# EAGLE design Companion_Board (EAGLE 7.5.0)
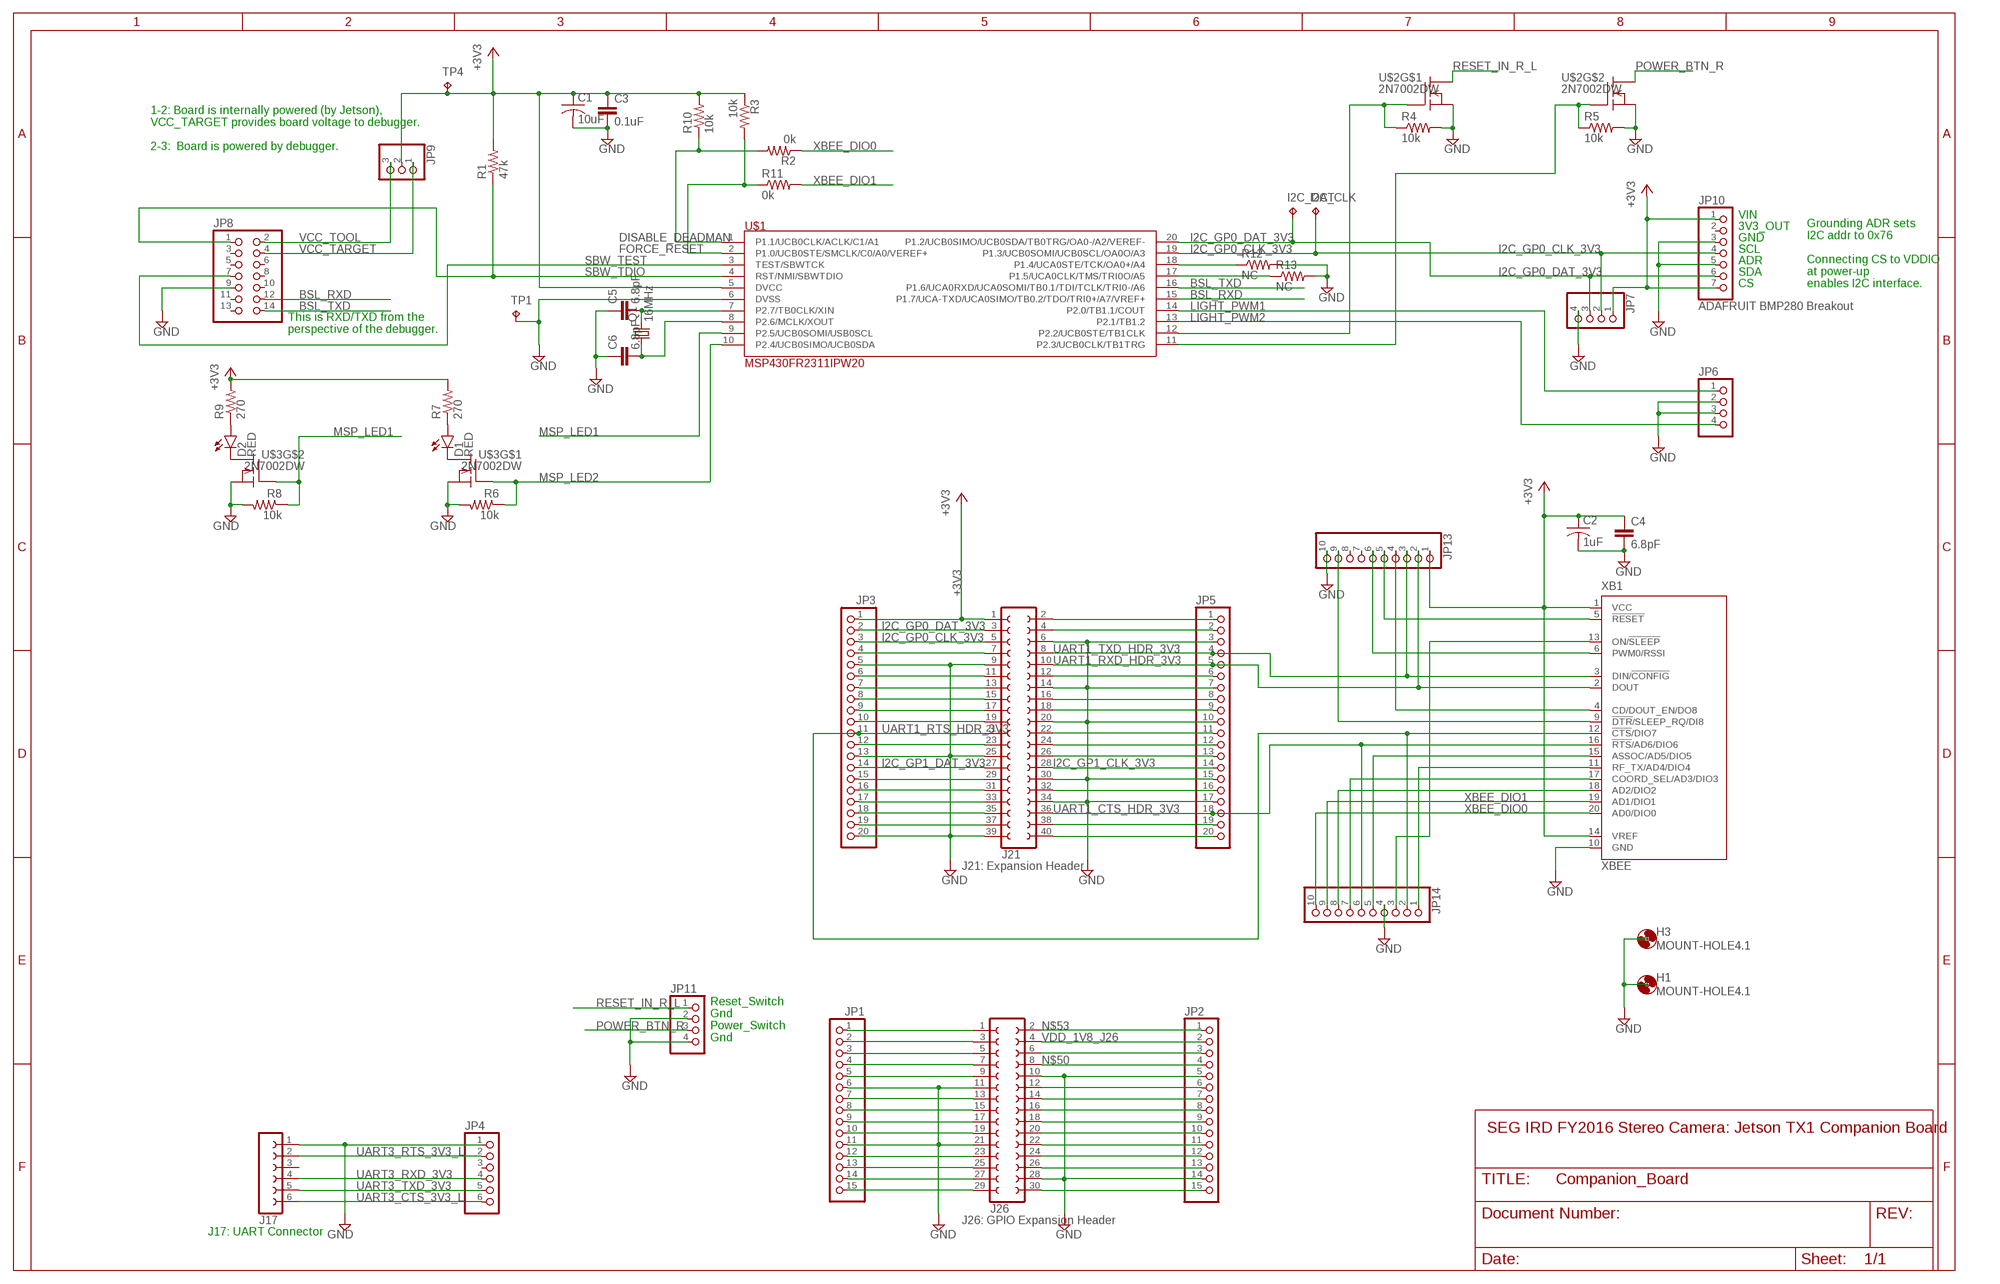
[diagram p0: schematic, sheet 1]

## Parts
C1  10uF  C-USC1206  [C1206]
C2  1uF  C-USC1206  [C1206]
C3  0.1uF  C-EUC0805  [C0805]
C4  6.8pF  C-EUC0805  [C0805]
C5  6.8pF  C-EUC0805  [C0805]
C6  6.8pF  C-EUC0805  [C0805]
D1  RED  LED-RED1206  [LED-1206]
D2  RED  LED-RED1206  [LED-1206]
H1  MOUNT-HOLE4.1  [4,1]
H3  MOUNT-HOLE4.1  [4,1]
I2C_CLK  TPPAD1-13  [P1-13]
I2C_DAT  TPPAD1-13  [P1-13]
J17  FE06-1  [FE06]
J21  FE20-2  [FE20-2]
J26  FE15-2  [FE15-2]
JP1  PINHD-1X15  [1X15]
JP2  PINHD-1X15  [1X15]
JP3  PINHD-1X20  [1X20]
JP4  PINHD-1X6  [1X06]
JP5  PINHD-1X20  [1X20]
JP6  PINHD-1X4/90  [1X04/90]
JP7  PINHD-1X4  [1X04]
JP8  PINHD-2X7  [2X07]
JP9  PINHD-1X3  [1X03]
JP10  ADAFRUIT BMP280 Breakout  ADAFRUIT_BMP280_BREAKOUT  [1X07]
JP11  PINHD-1X4/90  [1X04/90]
JP13  PINHD-1X10  [1X10]
JP14  PINHD-1X10  [1X10]
Q1  16MHz  CRYSTALHC49UP  [HC49UP]
R1  47k  R-US_R0805  [R0805]
R2  0k  R-US_R0805  [R0805]
R3  10k  R-US_R0805  [R0805]
R4  10k  R-US_R0805  [R0805]
R5  10k  R-US_R0805  [R0805]
R6  10k  R-US_R0805  [R0805]
R7  270  R-US_R0805  [R0805]
R8  10k  R-US_R0805  [R0805]
R9  270  R-US_R0805  [R0805]
R10  10k  R-US_R0805  [R0805]
R11  0k  R-US_R0805  [R0805]
R12  NC  R-US_R0805  [R0805]
R13  NC  R-US_R0805  [R0805]
TP1  TPPAD1-13  [P1-13]
TP4  TPPAD1-13  [P1-13]
U$1  MSP430FR2311IPW20  [SOP65P640X120-20N]
U$2  2N7002DW  [SOT363]
U$3  2N7002DW  [SOT363]
XB1  XBEE  [XBEE]

## Nets
+3V3: C1.1 C2.1 C3.1 C4.1 J21.1 JP3.1 JP7.1 JP9.2 JP10.1 JP10.7 JP13.1 R1.2 R3.1 R7.2 R9.2 R10.2 TP4.TP U$1.5(DVCC) XB1.1(VCC) XB1.14(VREF)
BSL_RXD: JP8.12 U$1.15(P1.7/UCA-TXD/UCA0SIMO/TB0.2/TDO/TRI0+/A7/VREF+)
BSL_TXD: JP8.14 U$1.16(P1.6/UCA0RXD/UCA0SOMI/TB0.1/TDI/TCLK/TRI0-/A6)
DISABLE_DEADMAN: R2.2 R10.1 U$1.1(P1.1/UCB0CLK/ACLK/C1/A1)
FORCE_RESET: R3.2 R11.1 U$1.2(P1.0/UCB0STE/SMCLK/C0/A0/VEREF+)
GND: C1.2 C2.2 C3.2 C4.2 C5.1 C6.1 J17.1 J21.6 J21.9 J21.14 J21.20 J21.25 J21.30 J21.34 J21.39 J26.10 J26.11 J26.21 J26.28 JP1.6 JP1.11 JP2.5 JP2.14 JP3.5 JP3.13 JP3.20 JP4.1 JP5.3 JP5.7 JP5.10 JP5.15 JP5.17 JP6.2 JP6.3 JP7.4 JP8.9 JP10.3 JP10.5 JP11.2 JP11.4 JP13.10 JP14.4 R4.2 R5.2 R6.2 R8.2 R12.2 R13.2 TP1.TP U$1.6(DVSS) U$2.1(S) U$2.4(S) U$3.1(S) U$3.4(S) XB1.10(GND)
I2C_GP0_CLK_3V3: I2C_CLK.TP J21.5 JP3.3 JP7.2 JP10.4 U$1.19(P1.3/UCB0SOMI/UCB0SCL/OA0O/A3)
I2C_GP0_DAT_3V3: I2C_DAT.TP J21.3 JP3.2 JP7.3 JP10.6 U$1.20(P1.2/UCB0SIMO/UCB0SDA/TB0TRG/OA0-/A2/VEREF-)
I2C_GP1_CLK_3V3: J21.28 JP5.14
I2C_GP1_DAT_3V3: J21.27 JP3.14
LIGHT_PWM1: JP6.1 U$1.14(P2.0/TB1.1/COUT)
LIGHT_PWM2: JP6.4 U$1.13(P2.1/TB1.2)
MSP_LED1: R8.1 U$1.9(P2.5/UCB0SOMI/USB0SCL) U$3.5(G)
MSP_LED2: R6.1 U$1.10(P2.4/UCB0SIMO/UCB0SDA) U$3.2(G)
N$1: J26.1 JP1.1
N$2: J26.3 JP1.2
N$3: J26.5 JP1.3
N$4: J26.7 JP1.4
N$5: J26.9 JP1.5
N$7: J26.13 JP1.7
N$8: J26.15 JP1.8
N$9: J26.17 JP1.9
N$10: J26.19 JP1.10
N$12: J26.23 JP1.12
N$13: J26.25 JP1.13
N$14: J26.27 JP1.14
N$15: J26.29 JP1.15
N$16: J26.30 JP2.15
N$17: J26.26 JP2.13
N$18: J26.24 JP2.12
N$19: J26.22 JP2.11
N$20: J26.20 JP2.10
N$21: J26.18 JP2.9
N$22: J26.16 JP2.8
N$23: J26.14 JP2.7
N$24: J26.12 JP2.6
N$25: R12.1 U$1.18(P1.4/UCA0STE/TCK/OA0+/A4)
N$26: J21.7 JP3.4
N$27: J26.6 JP2.3
N$28: J21.11 JP3.6
N$29: J21.13 JP3.7
N$30: J21.15 JP3.8
N$31: J21.19 JP3.10
N$33: J21.23 JP3.12
N$34: R13.1 U$1.17(P1.5/UCA0CLK/TMS/TRI0O/A5)
N$35: J21.29 JP3.15
N$36: J21.31 JP3.16
N$37: J21.33 JP3.17
N$38: J21.35 JP3.18
N$39: J21.37 JP3.19
N$41: C5.2 Q1.2 U$1.7(P2.7/TB0CLK/XIN)
N$42: J21.12 JP5.6
N$43: J21.16 JP5.8
N$44: J21.18 JP5.9
N$45: J21.22 JP5.11
N$46: J21.24 JP5.12
N$47: C6.2 Q1.1 U$1.8(P2.6/MCLK/XOUT)
N$48: D1.C U$3.6(D)
N$49: J21.32 JP5.16
N$50: J21.4 JP5.2
N$51: J21.38 JP5.19
N$52: J21.40 JP5.20
N$53: J21.17 JP3.9
N$54: J26.8 JP2.4
N$55: J26.2 JP2.1
N$56: R4.1 U$1.12(P2.2/UCB0STE/TB1CLK) U$2.2(G)
N$57: R5.1 U$1.11(P2.3/UCB0CLK/TB1TRG) U$2.5(G)
N$58: D2.C U$3.3(D)
N$59: JP13.5 XB1.5(!RESET)
N$60: JP13.6 XB1.6(PWM0/RSSI)
N$61: JP13.4 XB1.4(CD/DOUT_EN/DO8)
N$62: JP13.9 XB1.9(!DTR!/SLEEP_RQ/DI8)
N$63: JP14.3 XB1.13(ON/!SLEEP)
N$64: JP14.5 XB1.15(ASSOC/AD5/DIO5)
N$65: JP14.1 XB1.11(RF_TX/AD4/DIO4)
N$66: JP14.7 XB1.17(COORD_SEL/AD3/DIO3)
N$67: JP14.8 XB1.18(AD2/DIO2)
N$70: D1.A R7.1
N$73: D2.A R9.1
POWER_BTN_R: JP11.3 U$2.3(D)
RESET_IN_R_L: JP11.1 U$2.6(D)
SBW_TDIO: JP8.1 R1.1 U$1.4(RST/NMI/SBWTDIO)
SBW_TEST: JP8.7 U$1.3(TEST/SBWTCK)
SPI_CS1_3V3: J21.26 JP5.13
UART1_CTS_HDR_3V3: J21.36 JP5.18 JP14.6 XB1.16(!RTS!/AD6/DIO6)
UART1_RTS_HDR_3V3: J21.21 JP3.11 JP14.2 XB1.12(!CTS!/DIO7)
UART1_RXD_HDR_3V3: J21.10 JP5.5 JP13.2 XB1.2(DOUT)
UART1_TXD_HDR_3V3: J21.8 JP5.4 JP13.3 XB1.3(DIN/!CONFIG)
UART3_CTS_3V3_L: J17.6 JP4.6
UART3_RTS_3V3_L: J17.2 JP4.2
UART3_RXD_3V3: J17.4 JP4.4
UART3_TXD_3V3: J17.5 JP4.5
VCC_TARGET: JP8.4 JP9.1
VCC_TOOL: JP8.2 JP9.3
VDD_1V8_J26: J26.4 JP2.2
VDD_5V0_IO_SYS: J21.2 JP5.1
XBEE_DIO0: JP14.10 R2.1 XB1.20(AD0/DIO0)
XBEE_DIO1: JP14.9 R11.2 XB1.19(AD1/DIO1)
Unconnected: J17.3 JP4.3 JP8.3 JP8.5 JP8.6 JP8.8 JP8.10 JP8.11 JP8.13 JP10.2 JP13.7 JP13.8

## Notes on the sheet
- 1-2: Board is internally powered (by Jetson), 
  VCC_TARGET provides board voltage to debugger.
  
  2-3:  Board is powered by debugger.
- VIN
- 3V3_OUT
- GND
- SCL
- ADR
- SDA
- CS
- Grounding ADR sets 
  I2C addr to 0x76
  
  Connecting CS to VDDIO 
  at power-up 
  enables I2C interface.
- This is RXD/TXD from the 
  perspective of the debugger.
- J21: Expansion Header
- Reset_Switch
  Gnd
  Power_Switch
  Gnd
- SEG IRD FY2016 Stereo Camera: Jetson TX1 Companion Board
- J26: GPIO Expansion Header
- J17: UART Connector

## Library data of the parts
C1 C2 = resistor:C-US: CAPACITOR, American symbol
C3-C6 = resistor:C-EU: CAPACITOR, European symbol
D1 D2 = SparkFun-LED:LED-RED: Assorted Red LEDs LilyPad 1206- DIO-09912 1206- DIO-00809 0603- DIO-00819 "SMART" means more efficient and expensive; PROD_ID: DIO-09912
H1 H3 = holes:MOUNT-HOLE: MOUNTING HOLE with drill center marker
I2C_CLK I2C_DAT TP1 TP4 = testpad:TP: Test pad
J17 = con-lsta:FE06-1: FEMALE HEADER; OC_FARNELL: unknown; OC_NEWARK: unknown
J21 = con-lsta:FE20-2: FEMALE HEADER; OC_FARNELL: unknown; OC_NEWARK: unknown
J26 = con-lsta:FE15-2: FEMALE HEADER; OC_FARNELL: unknown; OC_NEWARK: unknown
JP1 JP2 = pinhead:PINHD-1X15: PIN HEADER
JP3 JP5 = pinhead:PINHD-1X20: PIN HEADER
JP4 = pinhead:PINHD-1X6: PIN HEADER
JP6 JP7 JP11 = pinhead:PINHD-1X4: PIN HEADER
JP8 = pinhead:PINHD-2X7: PIN HEADER
JP9 = pinhead:PINHD-1X3: PIN HEADER
JP10 = companion_board:ADAFRUIT_BMP280_BREAKOUT: PIN HEADER
JP13 JP14 = pinhead:PINHD-1X10: PIN HEADER
Q1 = crystal:CRYSTAL: CRYSTAL; OC_FARNELL: unknown; OC_NEWARK: unknown
R1-R13 = resistor:R-US_: RESISTOR, American symbol
U$1 = companion_board:MSP430FR2311IPW20
U$2 U$3 = companion_board:2N7002DW
XB1 = maxstream:XBEE: XBee (TM) /XBee-PRO(TM) OEM RF Modules Source: MaxStream, Inc. xbee_productmanual.pdf; MPN: XBP24-Z7UIT-004; OC_FARNELL: 1751799; OC_NEWARK: 34R5507

## Board
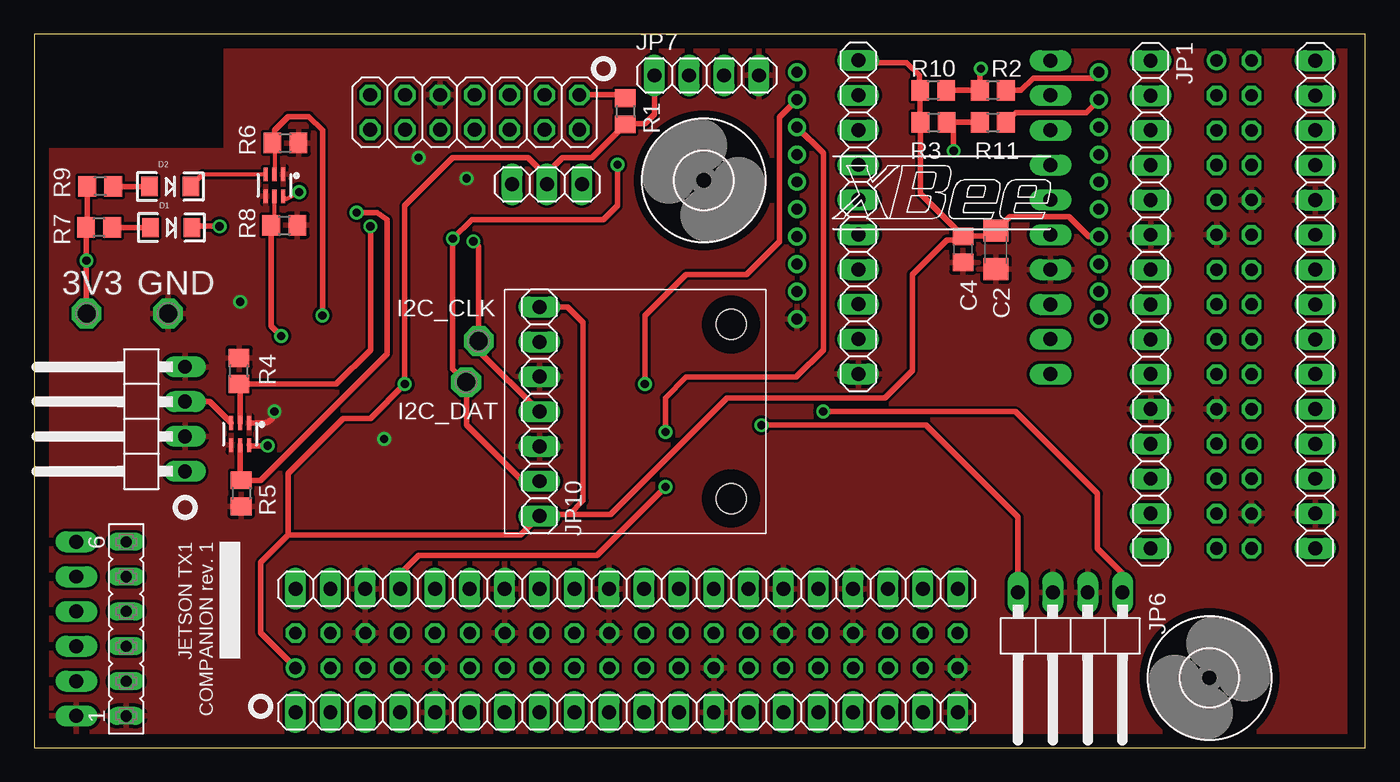
[diagram p1: board, top side]
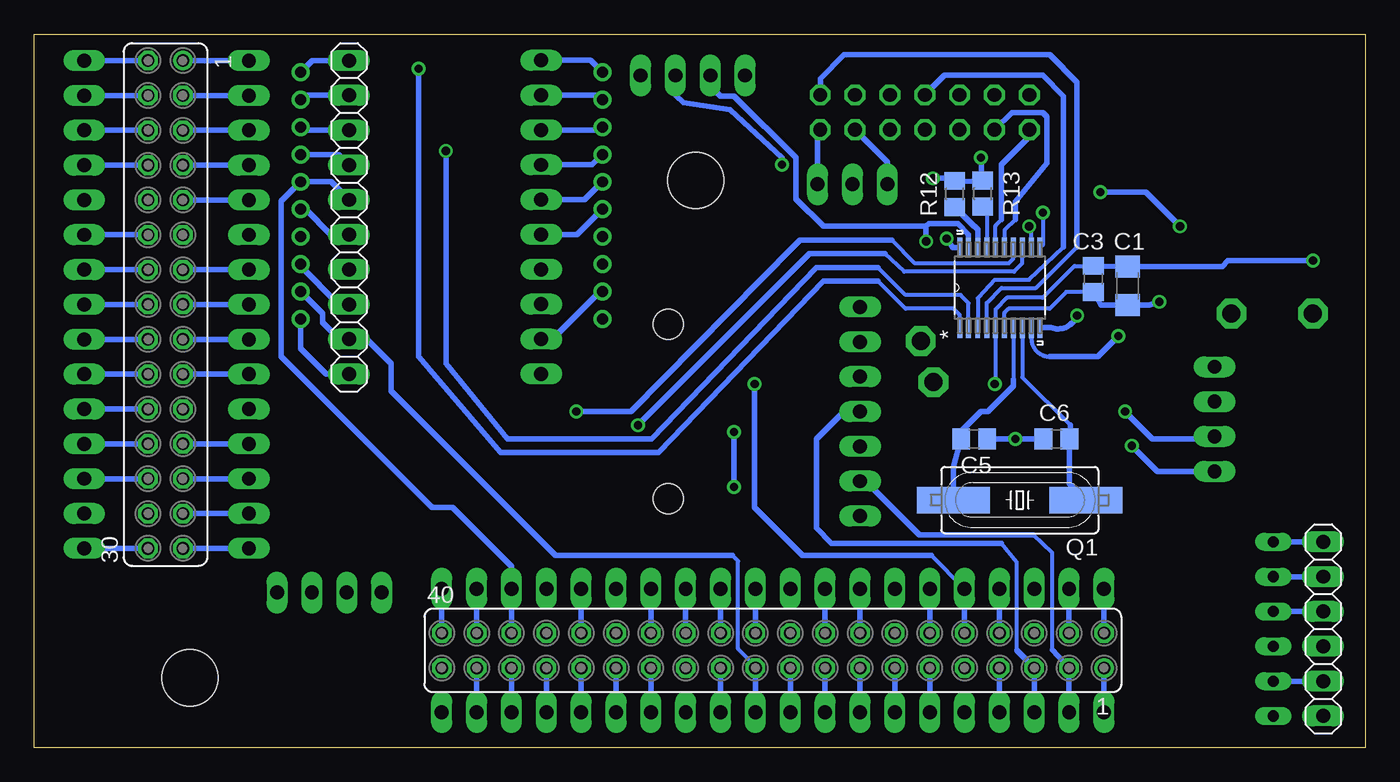
[diagram p2: board, bottom side, seen from below]

Size 97 x 52 mm. Coordinates in mm from the lower left corner, seen from the top.
Outline: 0,0 97,0 97,52 0,52 0,0
Copper layers (1*16): Top 0.035mm / dielectric 1.5mm / Bottom 0.035mm
Design rules "default": minimum track width 10mil, minimum drill 24mil, track to track 8mil, track to pad 8mil, pad to pad 8mil, via to via 8mil, smd to smd 8mil, copper to edge 40mil, drill to drill 8mil, minimum pad ring 10mil, minimum via ring 8mil, stop-mask expansion 4mil, vias tented up to drill 0mil, thermal gap 10mil

### Footprints (pad centres in the part's own frame; a part is rotated, then mirrored left to right if it is on the bottom)
C1206 = smd 1.6 x 1.8: 1 -1.4,0; 2 1.4,0
C0805 = smd 1.3 x 1.5: 1 -0.95,0; 2 0.95,0
LED-1206 = smd 1.2 x 1.4: A -1.5,0; C 1.5,0
4,1 = hole 4.1: 0,0
P1-13 = drill 1.321 pad 2.159 octagon: TP 0,0
FE06 = drill 0.813 long: 1 -6.35,0; 2 -3.81,0; 3 -1.27,0; 4 1.27,0; 5 3.81,0; 6 6.35,0
FE20-2 = drill 0.914: 1 -24.13,1.27 | drill 0.914 octagon: 2 -24.13,-1.27; 3 -21.59,1.27; 4 -21.59,-1.27; 5 -19.05,1.27; 6 -19.05,-1.27; 7 -16.51,1.27; 8 -16.51,-1.27; 9 -13.97,1.27; 10 -13.97,-1.27; 11 -11.43,1.27; 12 -11.43,-1.27; 13 -8.89,1.27; 14 -8.89,-1.27; 15 -6.35,1.27; 16 -6.35,-1.27; 17 -3.81,1.27; 18 -3.81,-1.27; 19 -1.27,1.27; 20 -1.27,-1.27; 21 1.27,1.27; 22 1.27,-1.27; 23 3.81,1.27; 24 3.81,-1.27; 25 6.35,1.27; 26 6.35,-1.27; 27 8.89,1.27; 28 8.89,-1.27; 29 11.43,1.27; 30 11.43,-1.27; 31 13.97,1.27; 32 13.97,-1.27; 33 16.51,1.27; 34 16.51,-1.27; 35 19.05,1.27; 36 19.05,-1.27; 37 21.59,1.27; 38 21.59,-1.27; 39 24.13,1.27; 40 24.13,-1.27
FE15-2 = drill 0.914: 1 -17.78,1.27 | drill 0.914 octagon: 2 -17.78,-1.27; 3 -15.24,1.27; 4 -15.24,-1.27; 5 -12.7,1.27; 6 -12.7,-1.27; 7 -10.16,1.27; 8 -10.16,-1.27; 9 -7.62,1.27; 10 -7.62,-1.27; 11 -5.08,1.27; 12 -5.08,-1.27; 13 -2.54,1.27; 14 -2.54,-1.27; 15 0,1.27; 16 0,-1.27; 17 2.54,1.27; 18 2.54,-1.27; 19 5.08,1.27; 20 5.08,-1.27; 21 7.62,1.27; 22 7.62,-1.27; 23 10.16,1.27; 24 10.16,-1.27; 25 12.7,1.27; 26 12.7,-1.27; 27 15.24,1.27; 28 15.24,-1.27; 29 17.78,1.27; 30 17.78,-1.27
1X15 = drill 1.016 long: 1 -17.78,0; 2 -15.24,0; 3 -12.7,0; 4 -10.16,0; 5 -7.62,0; 6 -5.08,0; 7 -2.54,0; 8 0,0; 9 2.54,0; 10 5.08,0; 11 7.62,0; 12 10.16,0; 13 12.7,0; 14 15.24,0; 15 17.78,0
1X20 = drill 1.016 long: 1 -24.13,0; 2 -21.59,0; 3 -19.05,0; 4 -16.51,0; 5 -13.97,0; 6 -11.43,0; 7 -8.89,0; 8 -6.35,0; 9 -3.81,0; 10 -1.27,0; 11 1.27,0; 12 3.81,0; 13 6.35,0; 14 8.89,0; 15 11.43,0; 16 13.97,0; 17 16.51,0; 18 19.05,0; 19 21.59,0; 20 24.13,0
1X06 = drill 1.016 long: 1 -6.35,0; 2 -3.81,0; 3 -1.27,0; 4 1.27,0; 5 3.81,0; 6 6.35,0
1X04/90 = drill 1.016 long: 1 -3.81,-3.81; 2 -1.27,-3.81; 3 1.27,-3.81; 4 3.81,-3.81
1X04 = drill 1.016 long: 1 -3.81,0; 2 -1.27,0; 3 1.27,0; 4 3.81,0
2X07 = drill 1.016 octagon: 1 -7.62,-1.27; 2 -7.62,1.27; 3 -5.08,-1.27; 4 -5.08,1.27; 5 -2.54,-1.27; 6 -2.54,1.27; 7 0,-1.27; 8 0,1.27; 9 2.54,-1.27; 10 2.54,1.27; 11 5.08,-1.27; 12 5.08,1.27; 13 7.62,-1.27; 14 7.62,1.27
1X03 = drill 1.016 long: 1 -2.54,0; 2 0,0; 3 2.54,0
1X07 = drill 1.016 long: 1 -7.62,0; 2 -5.08,0; 3 -2.54,0; 4 0,0; 5 2.54,0; 6 5.08,0; 7 7.62,0 | hole 2.2: -6.35,13.97; 6.35,13.97
1X10 = drill 1.016 long: 1 -11.43,0; 2 -8.89,0; 3 -6.35,0; 4 -3.81,0; 5 -1.27,0; 6 1.27,0; 7 3.81,0; 8 6.35,0; 9 8.89,0; 10 11.43,0
HC49UP = smd 5.334 x 1.93: 1 -4.826,0; 2 4.826,0
R0805 = smd 1.3 x 1.5: 1 -0.95,0; 2 0.95,0
SOP65P640X120-20N = smd 1.473 x 0.356: 1 -2.921,2.921; 2 -2.921,2.286; 3 -2.921,1.626; 4 -2.921,0.965; 5 -2.921,0.33; 6 -2.921,-0.33; 7 -2.921,-0.965; 8 -2.921,-1.626; 9 -2.921,-2.286; 10 -2.921,-2.921; 11 2.921,-2.921; 12 2.921,-2.286; 13 2.921,-1.626; 14 2.921,-0.965; 15 2.921,-0.33; 16 2.921,0.33; 17 2.921,0.965; 18 2.921,1.626; 19 2.921,2.286; 20 2.921,2.921
SOT363 = smd 0.3 x 0.99: 1 -0.65,-0.8; 2 0,-0.8; 3 0.65,-0.8; 4 0.65,0.81; 5 0,0.81; 6 -0.65,0.81
XBEE = drill 0.8 pad 1.27: 1 -11,9; 2 -11,7; 3 -11,5; 4 -11,3; 5 -11,1; 6 -11,-1; 7 -11,-3; 8 -11,-5; 9 -11,-7; 10 -11,-9; 11 11,-9; 12 11,-7; 13 11,-5; 14 11,-3; 15 11,-1; 16 11,1; 17 11,3; 18 11,5; 19 11,7; 20 11,9

### Placement (x,y rotation side)
C1  17.31,33.67 270 bottom
C2  70.08,36.29 270 top
C3  19.81,34.17 270 bottom
C4  67.69,36.32 270 top
C5  28.5,22.5 180 bottom
C6  22.5,22.5 0 bottom
D1  9.98,37.91 0 top
D2  9.9,40.91 0 top
H1  48.79,41.35 90 top
H3  85.65,5.08 0 top
I2C_CLK  32.39,29.64 0 top
I2C_DAT  31.47,26.64 0 top
J17  6.7,8.65 90 top
J21  43.17,7.08 180 bottom
J26  87.44,32.3 270 bottom
JP1  81.36,32.3 270 top
JP2  93.36,32.3 270 top
JP3  43.17,2.58 0 top
JP4  3.06,8.65 90 bottom
JP5  43.17,11.58 0 top
JP6  75.5,7.5 180 top
JP7  49,49 0 top
JP8  32.1,46.31 180 top
JP9  37.37,41.06 0 top
JP10  36.81,24.5 270 top
JP11  7.17,23.95 90 top
JP13  60.06,38.67 270 top
JP14  74.06,38.66 90 bottom
Q1  25.18,18.04 180 bottom
R1  43.08,46.38 270 top
R2  69.86,47.92 180 top
R3  65.54,45.58 0 top
R4  14.92,27.46 90 top
R5  15.08,18.54 270 top
R6  18.3,44.08 0 top
R7  4.72,37.92 180 top
R8  18.22,38.08 0 top
R9  4.8,40.92 180 top
R10  65.51,47.92 180 top
R11  69.86,45.58 0 top
R12  29.92,40.36 90 bottom
R13  27.88,40.39 90 bottom
TP1  9.75,31.64 0 top
TP4  3.81,31.64 0 top
U$1  26.62,33.53 90 bottom
U$2  15,22.86 180 top
U$3  17.5,41 180 top
XB1  66.6,40.24 0 top

### Tracks (layer width: path | path; a pad name or v marks a point on that pad's centre or on a via)
+3V3  (via drill 0.6)
  Top 0.406: 18.5,15.5 16.5,13.5 16.5,8.35 J21.1 | 18.5,15.5 35.43,15.5 JP10.7 36.93,17 39,17 | 39,17 40,18 40,31 38.88,32.12 JP10.1 | JP13.1 60.24,49.92 63.58,49.92 64.5,49 64.5,47.98 R10.2 64.56,46.11 R3.1 64.59,40.37 C4.1 | C4.1 69.66,37.27 C2.1 71.09,38.7 75.4,38.7 76.86,37.24 XB1.14 | 18.5,15.5 18.5,20 22.5,24 24.5,24 v27,26.5 27,39.5 30.5,43 36,43 37.37,41.63 JP9.2 37.37,41.87 38.5,43 40.65,43 R1.2 43.15,45.5 44.5,45.5 45.19,46.19 JP7.1 | 39,17 42,17 50.5,25.5 62,25.5 64,27.5 64,34.5 66.5,37 67.42,37 C4.1 | TP4.TP v3.8,35.5 3.77,35.53 R7.2 3.85,38 R9.2
  Bottom 0.305: 26.95,26.45 U$1.5 26.95,31.95 26.1,32.8 23.5,32.8 21.18,35.12 C3.1
  Bottom 0.406: C3.1 19.26,35.12 C1.1 10.43,35.07 10,35.5 v3.8,35.5 | v27,26.5 26.95,26.45 | JP3.1 J21.1 | JP13.1 56.46,50.1 XB1.1
BSL_RXD
  Bottom 0.305: 25.5,38.5 26.29,37.71 U$1.15
  Bottom 0.406: JP8.12 25.76,46.3 23.5,46.3 23.2,46 23.2,42.6 25.5,39.8 25.5,38.5
BSL_TXD
  Bottom 0.305: U$1.16 26.95,38.05 26.5,38.5
  Bottom 0.406: 26.5,38.5 26.5,42.5 24.48,44.52 JP8.14
DISABLE_DEADMAN  (via drill 0.6)
  Top 0.406: R10.1 R2.2 68.91,49.09 v69,49.5
  Bottom 0.305: U$1.1 29.54,31.54 30,32 33.5,32 35.5,34
  Bottom 0.406: 35.5,34 39.5,34 51.5,21.5 63,21.5 69,28.5 v69,49.5
FORCE_RESET  (via drill 0.6)
  Top 0.305: R3.2 66.49,45.51 66.5,45.5 66.75,45.75
  Top 0.406: R11.1 R3.2 | v67,43.5 67,45.5 66.75,45.75 66.5,46
  Bottom 0.305: U$1.2 28.91,32.41 29.5,33 33.5,33 35.5,35
  Bottom 0.406: 35.5,35 40,35 52,22.5 62.5,22.5 67,28 v67,43.5
GND  (via drill 0.6)
  Top 0.406: U$2.1 16.66,23.66 arc90 v17.5,24.5
  Bottom 0.305: U$1.6 26.29,31.71 26,32 23,32 21.78,33.22 C3.2
  Bottom 0.406: R13.2 27.99,41.33 | 27.99,41.33 29.35,41.24 R12.2 29.92,41.42 30,41.5 v31.5,41.5 | v15,32.5 15.73,32.27 C1.2 19.26,32.27 C3.2 | v28,43 27.99,42.49 27.99,41.33 | v17.5,24.5 15.5,22.5 11,22.5 11,22.66 JP11.2 | C6.1 v25.5,22.5 C5.1
  pour Top: 1,1 95.5,1 95.5,51 14,51 14,43.5 1,43.5
I2C_GP0_CLK_3V3  (via drill 0.6)
  Top 0.406: JP10.4 32.39,28.92 I2C_CLK.TP 32.39,36.51 v32,36.9
  Bottom 0.305: 25.4,7.09 25.4,13.5 26.5,14.9
  Bottom 0.406: 25.4,7.09 J21.5 JP3.3 | 26.5,14.9 38.9,14.9 40,16 40,22.5 38,24.5 JP10.4 | U$1.19 28.91,37.41 29.7,38.2 31.8,38.2 32,38 | 32,38 v32,36.9 | 32,38 39.5,38 41.5,40 41.5,43 46,47.5 47,47.5 47.73,48.23 JP7.2
I2C_GP0_DAT_3V3  (via drill 0.6)
  Top 0.406: JP10.6 36.73,19.5 35.5,19.5 31.5,23.5 31.5,26 | 31.5,26 31.5,26.5 | 31.5,26 31.47,26.03 I2C_DAT.TP 30.5,27.61 v30.5,37.1 31.9,38.5 41.5,38.5 42.5,39.5 v42.5,42.5
  Bottom 0.305: 22.8,7.13 22.8,14.2 24.2,15.5
  Bottom 0.406: U$1.20 30.05,36.45 30.1,36.5 v30.5,37.1 | 37,19.5 36.89,19.5 | 36.89,19.5 JP10.6 | 22.8,7.13 J21.3 JP3.2 | 24.2,15.5 32.5,15.5 36.5,19.5 36.89,19.5 | JP7.3 50.27,47.57 49.7,47 46.3,46.5 42.5,43 v42.5,42.5
I2C_GP1_CLK_3V3
  Bottom 0.406: J21.28 JP5.14
I2C_GP1_DAT_3V3
  Bottom 0.406: JP3.14 J21.27
LIGHT_PWM1  (via drill 0.6)
  Top 0.406: v57.5,24.5 71.5,24.5 77.49,18.51 77.49,14.51 79.31,12.69 JP6.1
  Bottom 0.305: U$1.14 25.66,35.65 26,35.3 32.8,35.3 34.5,37
  Bottom 0.406: 41.5,36.7 41.6,36.6 | 41.6,36.6 53.5,24.5 v57.5,24.5 | 34.5,37 41.2,37 41.6,36.6
LIGHT_PWM2  (via drill 0.6)
  Top 0.406: v53,23.5 65,23.5 71.69,16.81 JP6.4
  Bottom 0.305: 35,36 33.6,34.7 25.6,34.7 24.99,35.31 U$1.13
  Bottom 0.406: 35,36 40.5,36 v53,23.5
MSP_LED1  (via drill 0.6)
  Top 0.305: 17.5,38.31 U$3.5
  Top 0.406: v18,30 17.27,30.73 R8.1 17.5,38.31
  Bottom 0.305: U$1.9 24.33,29.83 arc-90 23,28.5
  Bottom 0.406: 23,28.5 19.5,28.5 v18,30
MSP_LED2  (via drill 0.6)
  Top 0.305: 17.5,43.93 U$3.2
  Top 0.406: v21,31.5 21,45 20,46 18.5,46 17.5,45 17.5,44.23 R6.1 17.5,43.93
  Bottom 0.406: U$1.10 22.89,30.61 arc-90 v21,31.5
N$1
  Bottom 0.406: J26.1 JP1.1
N$2
  Bottom 0.406: JP1.2 J26.3
N$3
  Bottom 0.406: J26.5 JP1.3
N$4
  Bottom 0.406: JP1.4 J26.7
N$5
  Bottom 0.406: J26.9 JP1.5
N$7
  Bottom 0.406: JP1.7 J26.13
N$8
  Bottom 0.406: J26.15 JP1.8
N$9
  Bottom 0.406: JP1.9 J26.17
N$10
  Bottom 0.406: J26.19 JP1.10
N$12
  Bottom 0.406: JP1.12 J26.23
N$13
  Bottom 0.406: J26.25 JP1.13
N$14
  Bottom 0.406: JP1.14 J26.27
N$15
  Bottom 0.406: J26.29 JP1.15
N$16
  Bottom 0.406: J26.30 JP2.15
N$17
  Bottom 0.406: JP2.13 J26.26
N$18
  Bottom 0.406: J26.24 JP2.12
N$19
  Bottom 0.406: JP2.11 J26.22
N$20
  Bottom 0.406: J26.20 JP2.10
N$21
  Bottom 0.406: JP2.9 J26.18
N$22
  Bottom 0.406: J26.16 JP2.8
N$23
  Bottom 0.406: JP2.7 J26.14
N$24
  Bottom 0.406: J26.12 JP2.6
N$25
  Bottom 0.406: U$1.18 28.25,37.75 28.5,38 28.51,38 R12.1
N$26
  Bottom 0.406: J21.7 JP3.4
N$27
  Bottom 0.406: J26.6 89,45 JP2.3 93.5,45
N$28
  Bottom 0.406: JP3.6 J21.11
N$29
  Bottom 0.406: JP3.7 J21.13
N$30
  Bottom 0.406: J21.15 JP3.8
N$31
  Bottom 0.406: JP3.10 J21.19
N$33
  Bottom 0.406: J21.23 JP3.12
N$34
  Bottom 0.305: R13.1 27.59,38.84 U$1.17
N$35
  Bottom 0.406: J21.29 JP3.15
N$36
  Bottom 0.406: J21.31 JP3.16
N$37
  Bottom 0.406: JP3.17 J21.33
N$38
  Bottom 0.406: J21.35 JP3.18
N$39
  Bottom 0.406: J21.37 JP3.19
N$41
  Bottom 0.305: U$1.7 25.66,26.84
  Bottom 0.406: 25.66,26.84 25.66,26.34 27.5,24.5 28,24.5 29.5,23 29.5,22.5 C5.2 30.01,20.44 Q1.2
N$42
  Bottom 0.406: J21.12 JP5.6
N$43
  Bottom 0.406: JP5.8 J21.16
N$44
  Bottom 0.406: J21.18 JP5.9
N$45
  Bottom 0.406: J21.22 JP5.11
N$46
  Bottom 0.406: JP5.12 J21.24
N$47
  Bottom 0.305: U$1.8 24.99,26.99 21.5,23.5
  Bottom 0.406: 21.5,23.5 21.5,22.5 | 21.5,22.5 21.5,22 21.35,22 | 21.5,22.5 C6.2 21.55,19.24 Q1.1
N$48  (via drill 0.6)
  Top 0.305: U$3.6 18.34,40 v19.3,40.5
  Top 0.406: D1.C 11.57,38 v13.5,38
  Bottom 0.406: v13.5,38 16,40.5 v19.3,40.5
N$49
  Bottom 0.406: JP5.16 J21.32
N$50
  Bottom 0.406: J21.4 JP5.2
N$51
  Bottom 0.406: JP5.19 J21.38
N$52
  Bottom 0.406: J21.40 JP5.20
N$53
  Bottom 0.406: JP3.9 J21.17
N$54
  Bottom 0.406: JP2.4 J26.8
N$55
  Bottom 0.406: J26.2 JP2.1
N$56  (via drill 0.6)
  Top 0.305: 15,26.5 R4.1
  Top 0.406: U$2.2 15,26.5 22,26.5 24.5,29 v24.5,38
  Bottom 0.305: U$1.12 24.33,37.83 v24.5,38
N$57  (via drill 0.6)
  Top 0.406: U$2.5 15,19.57 R5.1 16.49,19.49 25.7,28.7 25.7,38.5 25,39 v23.5,39
  Bottom 0.305: v23.5,39 23.5,36.65 U$1.11
N$58
  Top 0.305: 12.29,41.8 U$3.3
  Top 0.406: D2.C 12.29,41.8
N$59
  Bottom 0.406: JP13.5 56.9,39.94 XB1.5
N$60
  Bottom 0.406: JP13.6 57.44,37.4 XB1.6
N$61
  Bottom 0.406: JP13.4 56.36,42.48 XB1.4
N$62
  Bottom 0.305: 55.76,33.24 XB1.9
  Bottom 0.406: JP13.9 59.22,29.78 55.76,33.24
N$63
  Bottom 0.406: XB1.13 77.6,35.1 74.81,32.31 JP14.3
N$64
  Bottom 0.406: JP14.5 75.39,37.39 77.24,39.24 XB1.15
N$65
  Bottom 0.406: JP14.1 75.73,27.23 77.6,29.1 XB1.11
N$66
  Bottom 0.406: JP14.7 74.83,43.24 XB1.17
N$67
  Bottom 0.406: XB1.18 77.37,45.01 JP14.8
N$70
  Top 0.406: D1.A R7.1
N$73
  Top 0.406: R9.1 D2.A
POWER_BTN_R
  Top 0.406: U$2.3 12.79,25.22 JP11.3
RESET_IN_R_L  (via drill 0.6)
  Top 0.406: v17,22 15.7,22 U$2.6
  Bottom 0.406: JP11.1 15.14,20.14 v17,22
SBW_TDIO
  Top 0.406: R1.1 42.83,47.58 JP8.1
  Bottom 0.305: U$1.4 27.59,32.41 26.5,33.5 24,33.5 21,36.5
  Bottom 0.406: 21,36.5 21,48.5 23,50.5 38,50.5 39.72,48.78 JP8.1
SBW_TEST
  Bottom 0.305: U$1.3 28.25,32.75 27,34.1 24.5,34.1 22,36.5
  Bottom 0.406: 22,36.5 22,47.5 23.5,49 30.68,49 JP8.7
SPI_CS1_3V3
  Bottom 0.406: JP5.13 J21.26
UART1_CTS_HDR_3V3
  Bottom 0.406: J21.36 JP5.18 62.22,13.22 66.5,17.5 68,17.5 79,28.5 79,39.84 XB1.16 75.37,41.24 JP14.6
UART1_RTS_HDR_3V3
  Bottom 0.305: 44.44,5.94 45.7,7.2 45.7,13.6 46.1,14
  Bottom 0.406: JP3.11 J21.21 44.44,5.94 | XB1.12 76,31.64 76,31 74.77,29.77 JP14.2 72.77,29.77 71,28 71,26 59,14 46.1,14
UART1_RXD_HDR_3V3  (via drill 0.6)
  Top 0.406: XB1.2 54.3,45.94 54.3,36.9 51.9,34.5 47.5,34.5 44.5,31.5 v44.5,26.5
  Bottom 0.305: JP5.5 31.62,14
  Bottom 0.406: J21.10 JP5.5 | JP13.2 55.92,47.56 XB1.2 | 31.62,14 41,14 44.5,17.5 v44.5,26.5
UART1_TXD_HDR_3V3  (via drill 0.6)
  Top 0.406: JP5.4 26.66,12.66 28,14 41,14 v46,19 | v46,23 46,25.5 47.5,27 55.5,27 57.5,29 57.5,43.34 XB1.3
  Bottom 0.406: JP5.4 J21.8 | JP13.3 55.82,45.02 XB1.3 | v46,23 v46,19
UART3_CTS_3V3_L
  Bottom 0.406: JP4.6 J17.6
UART3_RTS_3V3_L
  Bottom 0.406: J17.2 JP4.2
UART3_RXD_3V3
  Bottom 0.406: JP4.4 J17.4
UART3_TXD_3V3
  Bottom 0.406: JP4.5 J17.5
VCC_TARGET
  Bottom 0.406: JP9.1 34.83,42.69 JP8.4
VCC_TOOL
  Bottom 0.406: JP9.3 39.91,44.85 JP8.2
VDD_1V8_J26
  Bottom 0.406: JP2.2 J26.4
VDD_5V0_IO_SYS
  Bottom 0.406: J21.2 JP5.1
XBEE_DIO0
  Top 0.406: R2.1 71.92,47.92 72.8,48.8 77.16,48.8 XB1.20
  Bottom 0.406: XB1.20 76.75,50.09 JP14.10
XBEE_DIO1
  Top 0.406: R11.2 71.53,46.3 76.66,46.3 XB1.19
  Bottom 0.406: XB1.19 77.29,47.55 JP14.9

### Text on the board
tSilk: 3V3 | GND | JETSON TX1 / COMPANION rev. 1 / 2016